# EAGLE design porcupine4v1_5 (EAGLE 5.11)
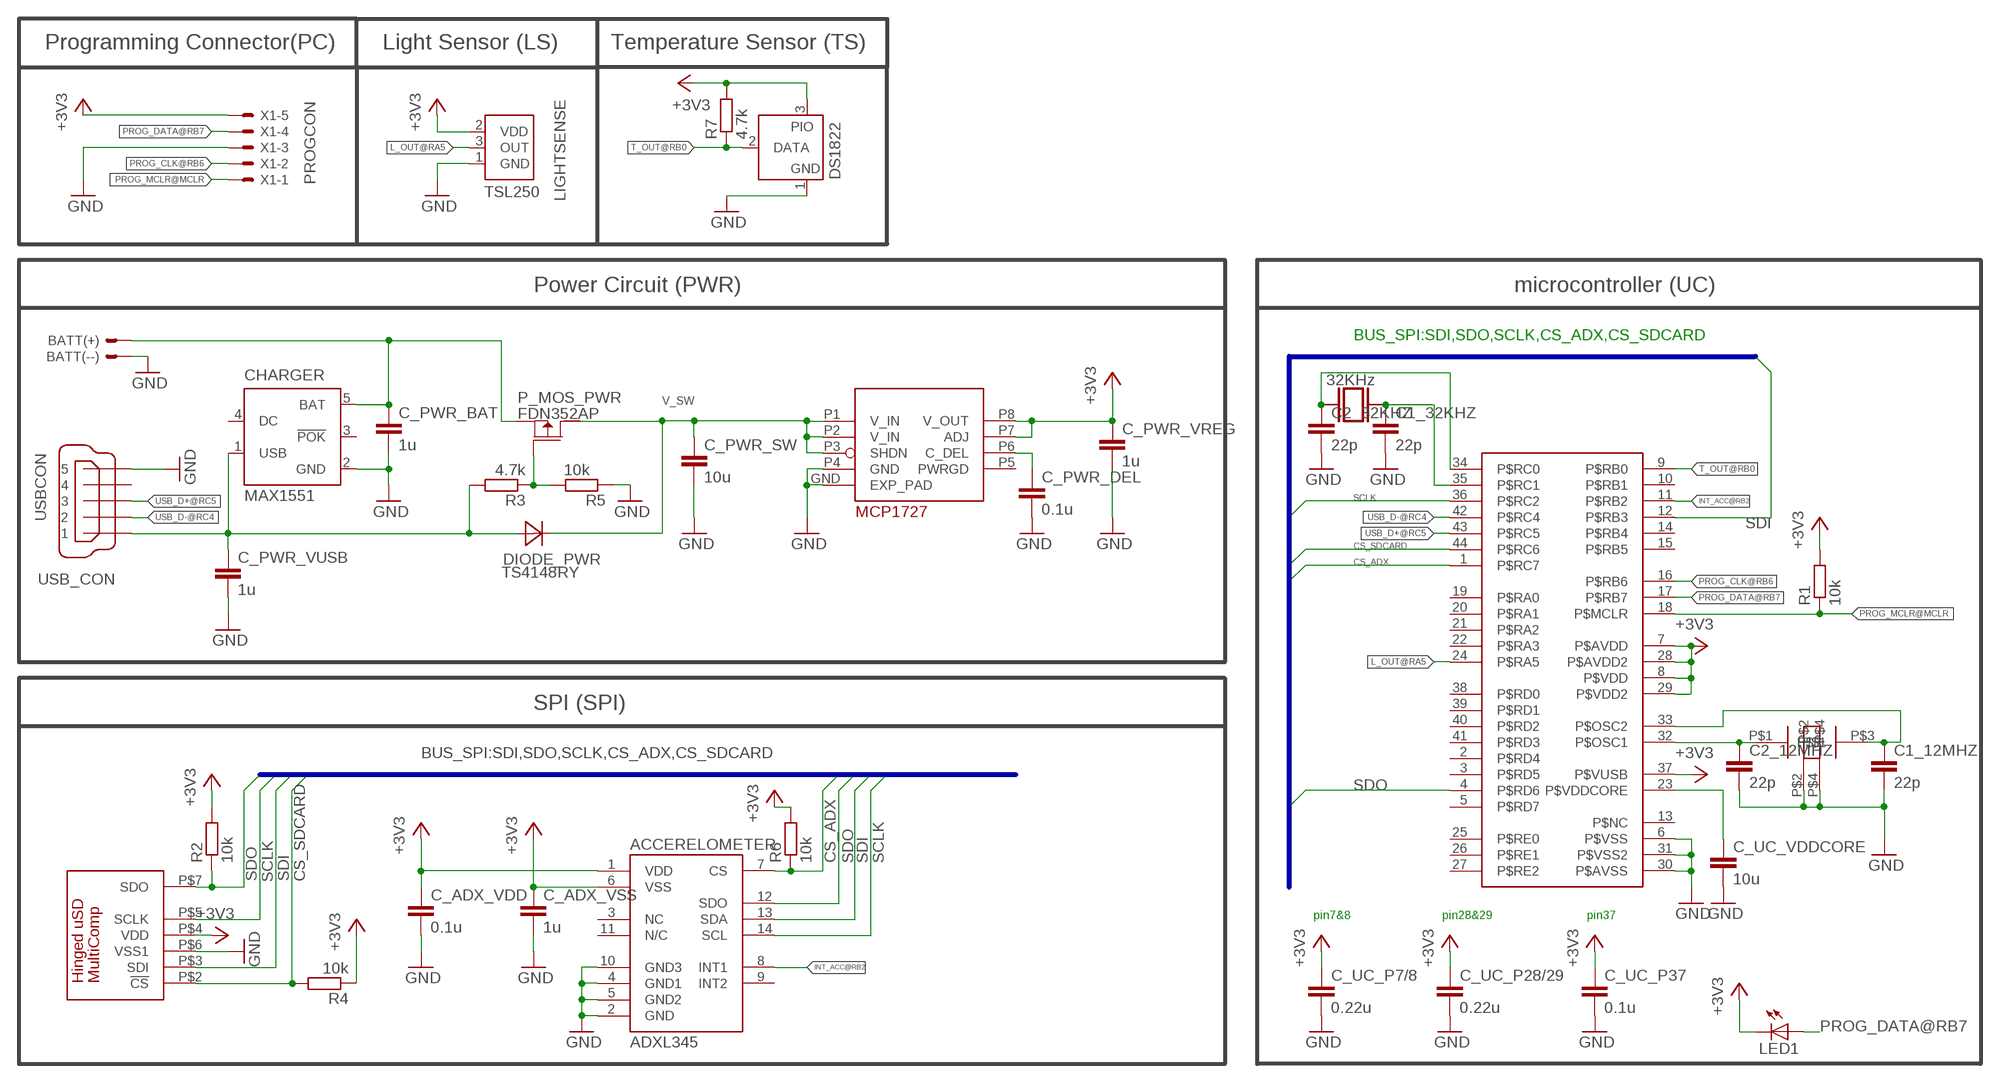
[diagram p0: schematic, sheet 1]

## Parts
ACCERELOMETER  ADXL345  [LGA14]
BATT  LI-ION-PACK  [LI-ION-CONNECT]
C1_12MHZ  22p  C-EUC0603K  [C0603K]
C1_32KHZ  22p  C-EUC0603K  [C0603K]
C2_12MHZ  22p  C-EUC0603K  [C0603K]
C2_32KHZ  22p  C-EUC0603K  [C0603K]
C_ADX_VDD  0.1u  C-EUC0603K  [C0603K]
C_ADX_VSS  1u  C-EUC0603K  [C0603K]
C_PWR_BAT  1u  C-EUC0603K  [C0603K]
C_PWR_DEL  0.1u  C-EUC0603K  [C0603K]
C_PWR_SW  10u  C-EUC0805K  [C0805K]
C_PWR_VREG  1u  C-EUC0603K  [C0603K]
C_PWR_VUSB  1u  C-EUC0603K  [C0603K]
C_UC_P7/8  0.22u  C-EUC0603K  [C0603K]
C_UC_P28/29  0.22u  C-EUC0603K  [C0603K]
C_UC_P37  0.1u  C-EUC0603K  [C0603K]
C_UC_VDDCORE  10u  C-EUC0805K  [C0805K]
CHARGER  MAX1551  [SOT23-5L]
CRYSTAL_12MHZ  12MHz  12MHZSMDCRYSTAL  [ABM3B]
CRYSTAL_32KHZ  32KHz  XTALSLOW  [TC26HSMD]
DIODE_PWR  TS4148RY  DIODE  [C0805]
LED1  LEDCHIPLED_0805  [CHIPLED_0805]
LIGHTSENSE  TSL250  [TSL]
P_MOS_PWR  FDN352AP  [SUPERSOT-3]
PIC_CONTROLLER  PIC_P2V6  [QFN44ML8X8]
R1  10k  R-EU_R0603  [R0603]
R2  10k  R-EU_R0603  [R0603]
R3  4.7k  R-EU_R0603  [R0603]
R4  10k  R-EU_R0603  [R0603]
R5  10k  R-EU_R0603  [R0603]
R6  10k  R-EU_R0603  [R0603]
R7  4.7k  R-EU_R0603  [R0603]
SDCARD_CON  MICROSD_CONN  [460DA40013]
TEMPSENSE  DS1822  DS2405  [TO92-]
USB_CON  USBCON  [248601]
VOLTAGEREG  MCP1727  [MCP_DFN_3X3X0.9]
X1  PROGCON  [53047-05-OCT]

## Nets
+3V3: ACCERELOMETER.1(VDD) ACCERELOMETER.6(VSS) C_ADX_VDD.1 C_ADX_VSS.1 C_PWR_VREG.1 C_UC_P7/8.1 C_UC_P28/29.1 C_UC_P37.1 LED1.C LIGHTSENSE.2(VDD) PIC_CONTROLLER.7(P$AVDD) PIC_CONTROLLER.8(P$VDD) PIC_CONTROLLER.28(P$AVDD2) PIC_CONTROLLER.29(P$VDD2) PIC_CONTROLLER.37(P$VUSB) R1.2 R2.2 R4.1 R6.2 R7.2 SDCARD_CON.P$4(VDD) TEMPSENSE.3(PIO) VOLTAGEREG.P7(ADJ) VOLTAGEREG.P8(V_OUT) X1.5
CS_ADX: ACCERELOMETER.7(CS) PIC_CONTROLLER.1(P$RC7) R6.1
CS_SDCARD: PIC_CONTROLLER.44(P$RC6) R4.2 SDCARD_CON.P$2(!CS)
GND: ACCERELOMETER.2(GND) ACCERELOMETER.4(GND1) ACCERELOMETER.5(GND2) ACCERELOMETER.10(GND3) BATT.3 C1_12MHZ.2 C1_32KHZ.2 C2_12MHZ.2 C2_32KHZ.2 C_ADX_VDD.2 C_ADX_VSS.2 C_PWR_BAT.2 C_PWR_DEL.2 C_PWR_SW.2 C_PWR_VREG.2 C_PWR_VUSB.2 C_UC_P7/8.2 C_UC_P28/29.2 C_UC_P37.2 C_UC_VDDCORE.2 CHARGER.2(GND) CRYSTAL_12MHZ.P$2 CRYSTAL_12MHZ.P$4 LIGHTSENSE.1(GND) PIC_CONTROLLER.6(P$VSS) PIC_CONTROLLER.30(P$AVSS) PIC_CONTROLLER.31(P$VSS2) R5.1 SDCARD_CON.P$6(VSS1) TEMPSENSE.1(GND) USB_CON.5 VOLTAGEREG.GND(EXP_PAD) VOLTAGEREG.P4(GND) X1.3
INT_ACC@RB2: ACCERELOMETER.8(INT1) PIC_CONTROLLER.11(P$RB2)
L_OUT@RA5: LIGHTSENSE.3(OUT) PIC_CONTROLLER.24(P$RA5)
N$1: P_MOS_PWR.1(G) R3.1 R5.2
N$3: C2_32KHZ.1 CRYSTAL_32KHZ.P$2 PIC_CONTROLLER.34(P$RC0)
N$4: C_PWR_DEL.1 VOLTAGEREG.P6(C_DEL)
N$6: C1_32KHZ.1 CRYSTAL_32KHZ.P$1 PIC_CONTROLLER.35(P$RC1)
N$8: C_UC_VDDCORE.1 PIC_CONTROLLER.23(P$VDDCORE)
OSC3: C2_12MHZ.1 CRYSTAL_12MHZ.P$1 PIC_CONTROLLER.32(P$OSC1)
OSC4: C1_12MHZ.1 CRYSTAL_12MHZ.P$3 PIC_CONTROLLER.33(P$OSC2)
PROG_CLK@RB6: PIC_CONTROLLER.16(P$RB6) X1.2
PROG_DATA@RB7: LED1.A PIC_CONTROLLER.17(P$RB7) X1.4
PROG_MCLR@MCLR: PIC_CONTROLLER.18(P$MCLR) R1.1 X1.1
SCLK: ACCERELOMETER.14(SCL) PIC_CONTROLLER.36(P$RC2) SDCARD_CON.P$5(SCLK)
SDI: ACCERELOMETER.13(SDA) PIC_CONTROLLER.12(P$RB3) SDCARD_CON.P$3(SDI)
SDO: ACCERELOMETER.12(SDO) PIC_CONTROLLER.4(P$RD6) R2.1 SDCARD_CON.P$7(SDO)
T_OUT@RB0: PIC_CONTROLLER.9(P$RB0) R7.1 TEMPSENSE.2(DATA)
USB_D+@RC5: PIC_CONTROLLER.43(P$RC5) USB_CON.3
USB_D-@RC4: PIC_CONTROLLER.42(P$RC4) USB_CON.2
V_BAT: BATT.1 C_PWR_BAT.1 CHARGER.5(BAT) P_MOS_PWR.2(S)
V_SW: C_PWR_SW.1 DIODE_PWR.2(C) P_MOS_PWR.3(D) VOLTAGEREG.P1(V_IN) VOLTAGEREG.P2(V_IN) VOLTAGEREG.P3(SHDN)
V_USB: C_PWR_VUSB.1 CHARGER.1(USB) DIODE_PWR.1(A) R3.2 USB_CON.1
Unconnected: ACCERELOMETER.3(NC) ACCERELOMETER.9(INT2) ACCERELOMETER.11(N/C) BATT.2 CHARGER.3(!POK) CHARGER.4(DC) PIC_CONTROLLER.2(P$RD4) PIC_CONTROLLER.10(P$RB1) PIC_CONTROLLER.13(P$NC) PIC_CONTROLLER.14(P$RB4) PIC_CONTROLLER.15(P$RB5) PIC_CONTROLLER.19(P$RA0) PIC_CONTROLLER.20(P$RA1) PIC_CONTROLLER.21(P$RA2) PIC_CONTROLLER.22(P$RA3) PIC_CONTROLLER.25(P$RE0) PIC_CONTROLLER.26(P$RE1) PIC_CONTROLLER.27(P$RE2) PIC_CONTROLLER.38(P$RD0) PIC_CONTROLLER.39(P$RD1) PIC_CONTROLLER.40(P$RD2) PIC_CONTROLLER.41(P$RD3) USB_CON.4 VOLTAGEREG.P5(PWRGD)

## Buses
BUS_SPI:SDI,SDO,SCLK,CS_ADX,CS_SDCARD

## Notes on the sheet
- Programming Connector(PC) | Light Sensor (LS) | Temperature Sensor (TS)
- Power Circuit (PWR) | microcontroller (UC)
- SPI (SPI)
- pin7&8 | pin28&29 | pin37

## Power pins joined to a net without a drawn wire
P$RD5: PIC_CONTROLLER.3(P$RD5)
P$RD7: PIC_CONTROLLER.5(P$RD7)

## Library data of the parts
ACCERELOMETER = HedgehogLib:ADXL345
BATT = HedgehogLib:LI-ION-PACK: Lithium Ion Battery Pack
C1_12MHZ C1_32KHZ C2_12MHZ C2_32KHZ C_ADX_VDD C_ADX_VSS C_PWR_BAT C_PWR_DEL C_PWR_SW C_PWR_VREG C_PWR_VUSB C_UC_P7/8 C_UC_P28/29 C_UC_P37 C_UC_VDDCORE = rcl:C-EU: CAPACITOR, European symbol
CHARGER = maxim:MAX1551: Dual-Input USB/AC Adapter 1-Cell Li+ Battery Chargers Source: http://www.maxim-ic.com .. MAX1551-MAX1555.pdf; MF: MAXIM; MPN: MAX1551EZK-T; OC_FARNELL: 1628221; OC_NEWARK: 88H0599
CRYSTAL_12MHZ = HedgehogLib:12MHZSMDCRYSTAL
CRYSTAL_32KHZ = HedgehogLib:XTAL
DIODE_PWR = HedgehogLib:DIODE
LED1 = led:LED: LED OSRAM: - CHIPLED LG R971, LG N971, LY N971, LG Q971, LY Q971, LO R971, LY R971 LH N974, LH R974 LS Q976, LO Q976, LY Q976 LO Q996 - Hyper CHIPLED LW Q18S LB Q993, LB Q99A, LB R99A - SideLED LS A670, LO A670, LY A670, LG A670, LP A670 LB A673, LV A673, LT A673, LW A673 LH A674 LY A675 LS A676, LA A676, LO A676, LY A676, LW A676 LS A679, LY A679, LG A679 - Hyper Micro SIDELED® LS Y876, LA Y876, LO Y876, LY Y876 LT Y87S - SmartLED LW L88C, LW L88S LB L89C, LB L89S, LG L890 LS L89K, LO L89K, LY L89K LS L896, LA L896, LO L896, LY L896 - TOPLED LS T670, LO T670, LY T670, LG T670, LP T670 LSG T670, LSP T670, LSY T670, LOP T670, LYG T670 LG T671, LOG T671, LSG T671 LB T673, LV T673, LT T673, LW T673 LH T674 LS T676, LA T676, LO T676, LY T676, LB T676, LH T676, LSB T676, LW T676 LB T67C, LV T67C, LT T67C, LS T67K, LO T67K, LY T67K, LW E67C LS E67B, LA E67B, LO E67B, LY E67B, LB E67C, LV E67C, LT E67C LW T67C LS T679, LY T679, LG T679 LS T770, LO T770, LY T770, LG T770, LP T770 LB T773, LV T773, LT T773, LW T773 LH T774 LS E675, LA E675, LY E675, LS T675 LS T776, LA T776, LO T776, LY T776, LB T776 LHGB T686 LT T68C, LB T68C - Hyper Mini TOPLED® LB M676 - Mini TOPLED Santana® LG M470 LS M47K, LO M47K, LY M47K Source: http://www.osram.convergy.de LUXEON: - LUMILED® LXK2-PW12-R00, LXK2-PW12-S00, LXK2-PW14-U00, LXK2-PW14-V00 LXK2-PM12-R00, LXK2-PM12-S00, LXK2-PM14-U00 LXK2-PE12-Q00, LXK2-PE12-R00, LXK2-PE12-S00, LXK2-PE14-T00, LXK2-PE14-U00 LXK2-PB12-K00, LXK2-PB12-L00, LXK2-PB12-M00, LXK2-PB14-N00, LXK2-PB14-P00, LXK2-PB14-Q00 LXK2-PR12-L00, LXK2-PR12-M00, LXK2-PR14-Q00, LXK2-PR14-R00 LXK2-PD12-Q00, LXK2-PD12-R00, LXK2-PD12-S00 LXK2-PH12-R00, LXK2-PH12-S00 LXK2-PL12-P00, LXK2-PL12-Q00, LXK2-PL12-R00 Source: www.luxeon.com KINGBRIGHT: KA-3528ASYC Source: www.kingbright.com
LIGHTSENSE = HedgehogLib:TSL250
P_MOS_PWR = HedgehogLib:FDN352AP
PIC_CONTROLLER = HedgehogLib:PIC_P2V6
R1-R7 = rcl:R-EU_: RESISTOR, European symbol
SDCARD_CON = HedgehogLib:MICROSD_CONN
TEMPSENSE = maxim:DS2405: Addressable Switch DALLAS Semiconductor; MF: DALLAS SEMICONDUCTOR; MPN: DS2405; OC_FARNELL: 1188025; OC_NEWARK: 06F4645
USB_CON = HedgehogLib:USBCON: MINI USB 2.0 Connector TypeB
VOLTAGEREG = HedgehogLib:MCP1727
X1 = HedgehogLib:PROGCON: Programmer Connector wire to board 1.25 mm (.049 inch) pitch header

## Board
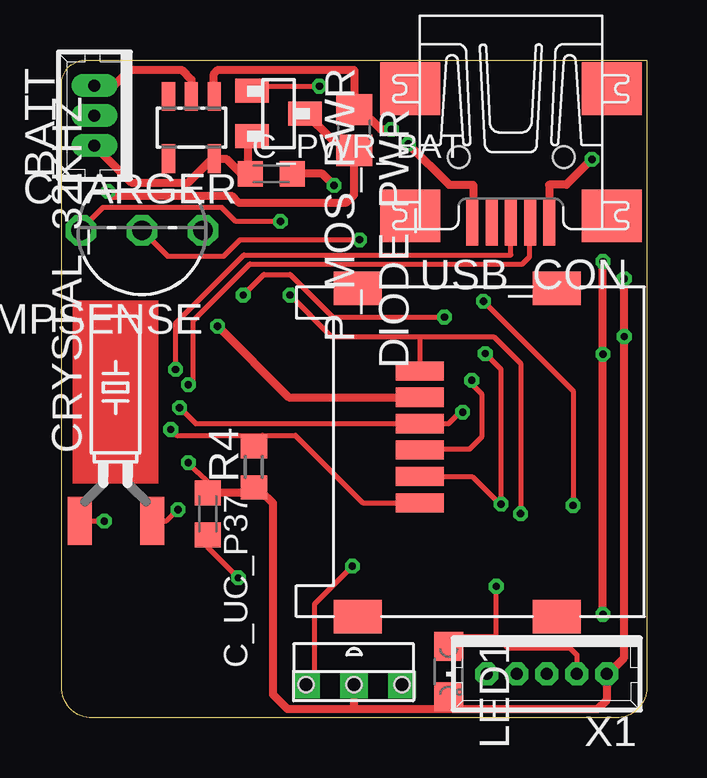
[diagram p1: board, top side]
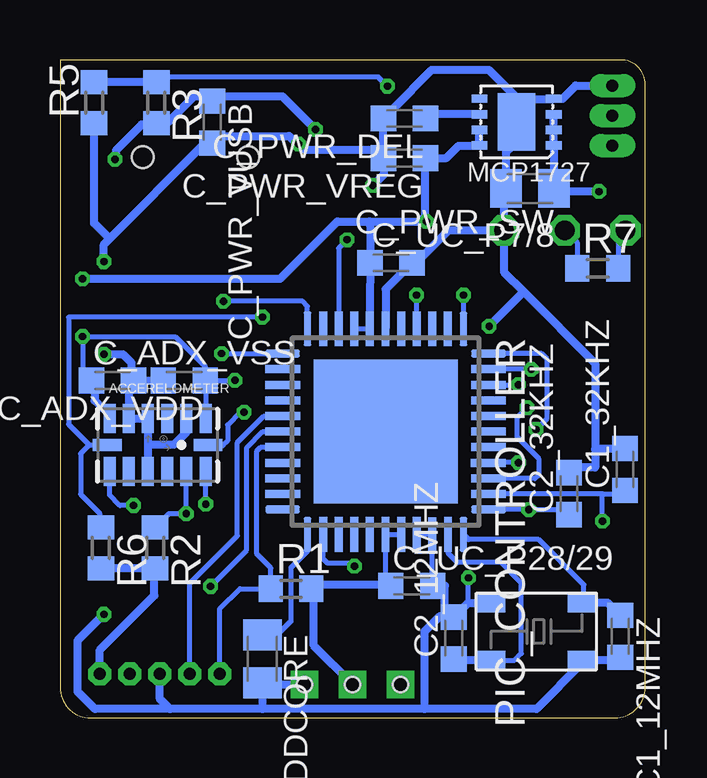
[diagram p2: board, bottom side, seen from below]

Size 24.38 x 27.43 mm. Coordinates in mm from the lower left corner, seen from the top.
Outline: 1.27,0 arc-90 0,1.27 0,26.42 arc-90 1.02,27.43 24.38,27.43 24.38,1.27 arc-90 23.11,0 1.27,0
Copper layers (1*16): Top 0.035mm / dielectric 1.5mm / Bottom 0.035mm
Design rules "default *": minimum track width 6mil, minimum drill 12mil, track to track 7mil, track to pad 7mil, pad to pad 7mil, via to via 7mil, smd to smd 7mil, copper to edge 6mil, drill to drill 6mil, minimum pad ring 9mil, minimum via ring 6mil, stop-mask expansion 4mil, vias tented up to drill 0mil, thermal gap 10mil

### Footprints (pad centres in the part's own frame; a part is rotated, then mirrored left to right if it is on the bottom)
LGA14 = smd 0.5 x 1.2: 1 2,1.1; 2 1.2,1.1; 3 0.4,1.1; 4 -0.4,1.1; 5 -1.2,1.1; 6 -2,1.1; 8 -2,-1.1; 9 -1.2,-1.1; 10 -0.4,-1.1; 11 0.4,-1.1; 12 1.2,-1.1; 13 2,-1.1 | smd 1.2 x 0.5: 7 -2.1,0; 14 2.1,0
LI-ION-CONNECT = drill 0.5 pad 0.698 long: 1 -2.5,0; 2 -1.25,0; 3 0,0
C0603K = smd 1.05 x 1.08: 1 -0.875,0; 2 0.875,0
C0805K = smd 1.3 x 1.6: 1 -1,0; 2 1,0
SOT23-5L = smd 0.55 x 1.2: 1 -0.95,-1.3; 2 0,-1.3; 3 0.95,-1.3; 4 0.95,1.3; 5 -0.95,1.3
ABM3B = smd 1.2 x 0.8: P$1 0.6,0.4; P$2 4.4,0.4; P$3 4.4,2.8; P$4 0.6,2.8
TC26HSMD = smd 1 x 2: P$1 -1.5,-0.8; P$2 1.522,-0.8
C0805 = smd 1.3 x 1.5: 1 -0.85,0; 2 0.85,0
CHIPLED_0805 = smd 1.2 x 1.2: A 0,-1.05; C 0,1.05
TSL = drill 0.635 pad 1.15 square: 1 -1.999,0; 2 0,0; 3 1.999,0 | hole 0.635: 0,0; -2,0; 2,0
SUPERSOT-3 = smd 1 x 1.4: 1 -0.95,-1.1; 2 0.95,-1.1; 3 0,1.1
QFN44ML8X8 = smd 1.45 x 0.33: 1 -4.282,3.25; 2 -4.285,2.6; 3 -4.285,1.95; 4 -4.285,1.3; 5 -4.285,0.65; 6 -4.287,0; 7 -4.285,-0.649; 8 -4.287,-1.3; 9 -4.287,-1.949; 10 -4.285,-2.6; 11 -4.285,-3.25; 23 4.285,-3.25; 24 4.287,-2.6; 25 4.287,-1.95; 26 4.287,-1.3; 27 4.287,-0.652; 28 4.287,0; 29 4.287,0.65; 30 4.292,1.3; 31 4.293,1.953; 32 4.293,2.602; 33 4.285,3.25 | smd 0.33 x 1.45: 12 -3.25,-4.288; 13 -2.6,-4.287; 14 -1.949,-4.287; 15 -1.3,-4.287; 16 -0.65,-4.287; 17 0,-4.287; 18 0.65,-4.287; 19 1.3,-4.287; 20 1.95,-4.287; 21 2.6,-4.287; 22 3.25,-4.285; 34 3.25,4.288; 35 2.6,4.287; 36 1.95,4.287; 37 1.3,4.285; 38 0.65,4.287; 39 0,4.287; 40 -0.649,4.287; 41 -1.3,4.287; 42 -1.949,4.287; 43 -2.6,4.287; 44 -3.25,4.288 | smd 6 x 6: EXP 0,0
R0603 = smd 1 x 1.1: 1 -0.85,0; 2 0.85,0
460DA40013 = smd 2 x 0.8: P$2 9.35,-4.75; P$3 9.35,-5.85; P$4 9.35,-6.95; P$5 9.35,-8.05; P$6 9.35,-9.15; P$7 9.35,-10.25 | smd 2 x 1.4: P$9A 11.95,0; P$9B 3.65,0; P$10A 11.95,-13.7; P$10B 3.65,-13.7
TO92- = drill 0.813 octagon: 1 -2.54,0; 2 0,0; 3 2.54,0
248601 = smd 2 x 0.5: 1 2.25,1.6; 2 2.25,0.8; 3 2.25,0; 4 2.25,-0.8; 5 2.25,-1.6 | smd 2.2 x 2.5: M1 -3.3,-4.2; M2 -3.3,4.2; M3 2,4.2; M4 2,-4.2 | hole 0.9: -0.449,-2.177; -0.447,2.21
MCP_DFN_3X3X0.9 = smd 2.4 x 1.55: GND 0,-1.55 | smd 0.35 x 0.65: P1 0.975,0; P2 0.325,0; P3 -0.325,0; P4 -0.975,0; P5 -0.975,-3.1; P6 -0.325,-3.1; P7 0.325,-3.1; P8 0.975,-3.1
53047-05-OCT = drill 0.5 pad 0.889 octagon: 1 2.5,0; 2 1.25,0; 3 0,0; 4 -1.25,0; 5 -2.5,0

### Placement (x,y rotation side)
ACCERELOMETER  20.32,11.38 0 bottom
BATT  1.37,26.37 90 top
C1_12MHZ  1.04,3.4 270 bottom
C1_32KHZ  0.84,10.36 90 bottom
C2_12MHZ  7.98,3.33 90 bottom
C2_32KHZ  3.17,9.35 90 bottom
C_ADX_VDD  19.2,14.07 180 bottom
C_ADX_VSS  22.2,14.07 0 bottom
C_PWR_BAT  8.74,22.68 0 top
C_PWR_DEL  10.03,24.99 180 bottom
C_PWR_SW  4.8,22.07 180 bottom
C_PWR_VREG  10.03,23.34 180 bottom
C_PWR_VUSB  18.04,24.84 270 bottom
C_UC_P7/8  10.59,18.97 0 bottom
C_UC_P28/29  9.72,5.51 0 bottom
C_UC_P37  6.09,8.51 270 top
C_UC_VDDCORE  15.95,2.46 270 bottom
CHARGER  5.41,24.61 180 top
CRYSTAL_12MHZ  7.04,2.01 0 bottom
CRYSTAL_32KHZ  2.25,9.02 0 top
DIODE_PWR  12.19,24.51 270 top
LED1  16.13,1.93 180 top
LIGHTSENSE  12.19,1.4 180 top
P_MOS_PWR  9.04,25.2 270 top
PIC_CONTROLLER  10.82,11.94 270 bottom
R1  14.76,5.38 0 bottom
R2  20.42,7.09 270 bottom
R3  20.37,25.65 270 bottom
R4  8.01,10.46 90 top
R5  22.96,25.65 90 bottom
R6  22.68,7.09 270 bottom
R7  1.98,18.75 0 bottom
SDCARD_CON  24.28,4.22 180 top
TEMPSENSE  3.35,20.32 180 top
USB_CON  18.72,22.93 270 top
VOLTAGEREG  3.81,24.84 270 bottom
X1  20.22,1.83 180 top

### Tracks (layer width: path | path; a pad name or v marks a point on that pad's centre or on a via)
+3V3  (via drill 0.3)
  Top 0.203: SDCARD_CON.P$4 14.97,11.2 16.99,11.2 17.5,11.71 17.5,13.51 17.09,13.92 v17.09,14.07 | TEMPSENSE.3 0.81,20.37 1.73,21.29 6.68,21.29 7.26,20.7 v9.12,20.7 | C_UC_P37.1 6.09,9.83 5.7,10.22 v5.28,10.64
  Top 0.254: LED1.C 16.15,0.78 16.15,0.37
  Top 0.33: v23.44,18.31 v23.44,15.9 23.44,2.52 22.76,1.83 X1.5 22.73,1.81 22.73,0.76 22.34,0.37 16.15,0.37 12.19,0.37 | 12.19,0.37 LIGHTSENSE.2 | 12.19,0.37 9.41,0.37 8.81,0.96 8.81,8.95 8.33,9.43 | SDCARD_CON.P$4 14.92,11.15 | 8.33,9.43 R4.1 | 8.33,9.43 8.33,9.38 C_UC_P37.1
  Bottom 0.203: ACCERELOMETER.1 18.32,13.84 C_ADX_VDD.1 | PIC_CONTROLLER.7 PIC_CONTROLLER.8 | 23.19,13.93 C_ADX_VSS.1 23.1,14.03 23.44,14.38 v23.44,15.9 19.58,15.9 18.34,14.66 18.34,13.85 C_ADX_VDD.1 | PIC_CONTROLLER.29 PIC_CONTROLLER.28 10.82,5.89 10.46,5.54 C_UC_P28/29.1 | v5.28,10.64 PIC_CONTROLLER.37 | C_ADX_VDD.1 v17.09,14.07 | R7.2 1.13,20 TEMPSENSE.3
  Bottom 0.33: ACCERELOMETER.6 22.32,12.91 22.61,12.91 22.94,13.23 22.94,13.81 C_ADX_VSS.1 | C_ADX_VDD.1 18.18,13.95 | VOLTAGEREG.P7 VOLTAGEREG.P8 6.93,23.85 7.77,23.85 8.28,23.34 C_PWR_VREG.1 9.16,20.91 9.37,20.7 | v23.44,18.31 15.21,18.31 12.83,20.7 11.48,20.7 | 10.87,5.56 10.66,5.58 C_UC_P28/29.1 10.88,5.56 13.73,5.56 R1.2 13.81,5.29 13.81,3.01 LIGHTSENSE.2 | 11.48,20.7 9.37,20.7 | 9.37,20.7 v9.12,20.7 | PIC_CONTROLLER.7 11.47,17.25 C_UC_P7/8.1 11.47,20.54 11.48,20.7 | R6.2 R2.2 20.45,6.27 20.45,5.11 22.72,2.83 X1.5
CS_ADX  (via drill 0.3)
  Top 0.203: v7.57,17.63 8.43,18.49 9.53,18.49 11.3,16.71 v15.95,16.71
  Bottom 0.203: PIC_CONTROLLER.1 7.57,17.37 v7.57,17.63 | v15.95,16.71 24.03,16.71 24.03,12.24 23.16,11.38 | 23.16,11.38 ACCERELOMETER.7 | 23.16,11.38 23.52,11.02 23.52,9.32 22.73,8.53 22.73,7.99 R6.1
CS_SDCARD  (via drill 0.3)
  Top 0.203: SDCARD_CON.P$2 12.56,8.97 9.74,11.79 8.38,11.79 | v4.55,12.03 4.8,11.78 8.38,11.79 | R4.2 8.38,11.12 8.38,11.79
  Bottom 0.203: PIC_CONTROLLER.44 4.32,15.19 4.09,14.96 4.09,12.49 v4.55,12.03
GND  (via drill 0.3, 0.3 pad 0.3)
  Top 0.203: C_UC_P37.2 6.09,7.12 v7.37,5.84
  Top 0.33: USB_CON.5 17.14,20.58 17.14,22.23 16.15,22.23 v14.45,23.93 | CHARGER.2 5.41,26.62 5,27.03 2.85,27.03 2.18,26.36 BATT.3 | C_PWR_BAT.2 10.87,22.68 v11.35,22.2 | v22.55,19.02 v22.55,15.16 v22.55,4.32 | SDCARD_CON.P$6 9.47,13.37 v6.5,16.33
  Bottom 0.203: PIC_CONTROLLER.30 PIC_CONTROLLER.31 8.87,5.97 8.87,5.68 C_UC_P28/29.2 | C_PWR_SW.2 5.89,22.26 | 21.52,13.82 21.44,13.82 C_ADX_VSS.2 | v7.37,5.84 7.37,5.66 7.37,4.81
  Bottom 0.305: C2_12MHZ.2 8.07,4.29
  Bottom 0.33: CRYSTAL_12MHZ.P$4 6.74,4.79 | C1_12MHZ.2 0.76,2.9 1.25,2.41 CRYSTAL_12MHZ.P$2 | CRYSTAL_12MHZ.P$2 2.62,2.43 | 21.52,13.82 ACCERELOMETER.5 ACCERELOMETER.4 20.72,11.39 | 20.72,11.39 ACCERELOMETER.10 | ACCERELOMETER.2 19.12,11.91 19.63,11.39 20.72,11.39 | C_ADX_VDD.2 C_ADX_VSS.2 21.41,13.9 21.41,14.81 21.77,15.16 v22.55,15.16 | 2.08,11.2 2.08,10.44 3.08,10.44 C2_32KHZ.2 | C1_32KHZ.2 2.05,11.24 2.08,11.2 | CRYSTAL_12MHZ.P$4 6.25,4.81 | BATT.3 2.9,26.36 3.44,25.82 VOLTAGEREG.P4 3.82,25.81 4.75,25.81 5.22,25.34 | C_PWR_VREG.2 10.91,24.18 C_PWR_DEL.2 10.53,25.39 8.9,27.02 6.51,27.02 CHARGER.2 5.41,25.53 5.22,25.34 | 5.22,25.34 5.36,25.2 VOLTAGEREG.GND 5.28,24.76 5.28,24 5.8,23.61 C_PWR_SW.2 | C_PWR_VREG.2 11.13,23.7 14.22,23.7 v14.45,23.93 14.5,23.93 14.83,24.26 18.02,24.26 C_PWR_VUSB.2 18.46,23.85 22.31,19.98 | v11.35,22.2 10.9,22.66 10.9,23.46 C_PWR_VREG.2 | 15.94,0.38 C_UC_VDDCORE.2 15.64,1.46 15.57,1.4 LIGHTSENSE.1 | 15.94,0.38 19.81,0.38 | v22.55,19.02 22.55,19.74 22.31,19.98 | 19.81,0.38 22.93,0.38 23.65,1.09 23.65,3.23 v22.55,4.32 | 7.94,4.24 C2_12MHZ.2 | CRYSTAL_12MHZ.P$4 7.37,4.81 7.94,4.24 | C2_12MHZ.2 8.01,4.33 | TEMPSENSE.1 8.2,20.32 9.55,18.97 C_UC_P7/8.2 10.82,17.87 PIC_CONTROLLER.6 | 5.89,22.26 TEMPSENSE.1 | CRYSTAL_12MHZ.P$2 2.64,2.27 4.53,0.38 9.19,0.38 | 9.19,0.38 15.94,0.38 | 7.94,4.24 8.56,4.24 9.19,3.61 9.19,0.38 | C_UC_P28/29.2 8.35,5.51 8.35,4.49 7.98,4.27 C2_12MHZ.2 | 2.08,11.2 2.08,14.78 5.07,17.77 | 5.07,17.77 5.89,18.59 TEMPSENSE.1 | 5.07,17.77 v6.5,16.33 | 19.81,0.38 20.22,0.79 X1.3 | R5.1 22.96,20.62 22.31,19.98
INT_ACC@RB2  (via drill 0.3)
  Top 0.203: v21.32,8.86 21.32,13.63 v17.58,17.37
  Bottom 0.203: ACCERELOMETER.8 22.32,9.29 21.89,8.86 v21.32,8.86 | v17.58,17.37 14.28,17.37 14.07,17.17 PIC_CONTROLLER.11
L_OUT@RA5  (via drill 0.3)
  Top 0.203: LIGHTSENSE.3 10.54,1.42 10.54,4.75 v12.12,6.33
  Bottom 0.203: PIC_CONTROLLER.24 13.42,6.64 13.23,6.45 12.24,6.45 v12.12,6.33
N$1  (via drill 0.3)
  Top 0.203: v10.74,26.34 8.11,26.34 P_MOS_PWR.1
  Bottom 0.203: R3.1 20.31,26.5 20.09,26.72 11.12,26.72 v10.74,26.34
  Bottom 0.33: R3.1 R5.2
N$3  (via drill 0.3)
  Top 0.203: 3.67,7.34 CRYSTAL_32KHZ.P$2 4.38,8.22 v4.85,8.69
  Bottom 0.203: C2_32KHZ.1 3.26,8.69 v4.85,8.69 PIC_CONTROLLER.34
N$4
  Bottom 0.33: C_PWR_DEL.1 9.12,25.17 VOLTAGEREG.P6
N$6  (via drill 0.3)
  Top 0.203: CRYSTAL_32KHZ.P$1 1.66,8.22 v1.78,8.2
  Bottom 0.203: PIC_CONTROLLER.35 1.78,9.35 | 1.78,9.35 0.71,9.35 0.7,9.47 C1_32KHZ.1 | v1.78,8.2 1.78,9.35
N$8
  Bottom 0.203: C_UC_VDDCORE.1 15.83,3.58 15.21,3.58 14.76,4.04 14.76,6.27 14.07,6.96 PIC_CONTROLLER.23
OSC3
  Bottom 0.203: 6.58,2.43 CRYSTAL_12MHZ.P$1 5.44,2.41 5.16,2.69 5.16,5.64 5.99,6.48 7.82,6.48 8.2,6.86 8.2,7.63 PIC_CONTROLLER.32 8.18,7.61 | C2_12MHZ.1 7.91,2.41 8.19,2.44
  Bottom 0.33: C2_12MHZ.1 7.93,2.41 CRYSTAL_12MHZ.P$1
OSC4
  Bottom 0.203: 2.16,4.76 CRYSTAL_12MHZ.P$3 2.55,4.93 2.55,5.55 4.45,7.44 7.36,7.44 PIC_CONTROLLER.33
  Bottom 0.33: C1_12MHZ.1 1.57,4.81 CRYSTAL_12MHZ.P$3
PROG_CLK@RB6
  Bottom 0.203: PIC_CONTROLLER.16 15.88,12.59 16.99,11.48 16.99,7.59 18.97,5.62 X1.2
PROG_DATA@RB7  (via drill 0.3)
  Top 0.203: 18.11,3.4 v18.11,5.49 | 18.11,3.4 18.59,2.92 21.18,2.92 21.47,2.64 X1.4 | LED1.A 16.48,3.41 18.11,3.4
  Bottom 0.203: v18.11,5.49 16.61,6.99 16.61,11.25 15.93,11.94 PIC_CONTROLLER.17
PROG_MCLR@MCLR
  Bottom 0.203: PIC_CONTROLLER.18 16.02,11.29 16.18,11.12 16.18,6.83 15.6,6.25 15.6,5.4 R1.1 16.89,5.38 17.72,4.56 X1.1
SCLK  (via drill 0.3)
  Top 0.203: v16.71,12.75 16.61,12.75 16.13,12.27 SDCARD_CON.P$5 5.59,12.27 v4.92,12.94
  Bottom 0.203: v16.71,12.75 16.87,12.75 17.4,12.22 17.4,11.56 17.6,11.35 18.09,11.35 18.17,11.43 ACCERELOMETER.14 | v4.92,12.94 5.34,12.52 5.34,11.71 4.42,10.79 4.42,10.16 4.6,9.98 PIC_CONTROLLER.36
SDI  (via drill 0.3)
  Top 0.203: v17.65,15.19 18.31,14.53 v18.31,8.91 18.24,8.94 17.11,10.07 SDCARD_CON.P$3
  Bottom 0.203: 15.14,15.21 PIC_CONTROLLER.12 v17.65,15.19 | ACCERELOMETER.13 18.32,9.08 v18.31,8.91
SDO  (via drill 0.3)
  Top 0.203: 14.93,15.9 SDCARD_CON.P$7 | 14.93,15.9 18.01,15.9 19.13,14.78 v19.13,8.51 | 14.93,15.9 11.25,15.9 v9.53,17.63
  Bottom 0.203: ACCERELOMETER.12 v19.13,8.51 19.85,8.51 R2.1 | v9.53,17.63 v9.52,17.62 PIC_CONTROLLER.4
T_OUT@RB0  (via drill 0.3)
  Top 0.203: v12.42,19.94 7.44,19.94 6.76,19.25 4.42,19.25 TEMPSENSE.2
  Bottom 0.203: PIC_CONTROLLER.9 12.78,19.58 v12.42,19.94 | TEMPSENSE.2 2.82,19.79 2.82,18.99 R7.1
USB_D+@RC5  (via drill 0.3)
  Top 0.203: USB_CON.3 18.72,20.56 18.72,19.3 7.59,19.3 4.75,16.46 v4.75,14.53
  Bottom 0.203: v4.75,14.53 v4.76,14.54 PIC_CONTROLLER.43
USB_D-@RC4  (via drill 0.3)
  Top 0.203: USB_CON.2 19.51,20.54 19.51,19.23 19.2,18.92 7.85,18.92 5.49,16.56 5.49,14.1 v5.28,13.89
  Bottom 0.203: v5.28,13.89 5.3,13.89 PIC_CONTROLLER.42
V_BAT
  Top 0.33: CHARGER.5 | 7.72,24.03 P_MOS_PWR.2 7.77,24.08 7.77,22.73 | CHARGER.5 6.86,23.32 7.44,22.73 7.77,22.73 | 7.77,22.73 8.17,22.73 C_PWR_BAT.1 | CHARGER.5 6.27,23.32 5.28,22.33 2.91,22.33 BATT.1
V_SW  (via drill 0.3)
  Top 0.33: P_MOS_PWR.3 10.19,25.2 11.28,24.11 12.18,24.11 DIODE_PWR.2 | DIODE_PWR.2 12.24,24.04 | DIODE_PWR.2 12.22,24.07 | v1.93,21.95 2.11,21.77 7.09,21.77 7.37,21.49 11.87,21.49 12.19,21.81 DIODE_PWR.2
  Bottom 0.33: VOLTAGEREG.P3 VOLTAGEREG.P2 VOLTAGEREG.P1 3.8,23.86 C_PWR_SW.1 3.8,22.37 3.38,21.95 v1.93,21.95
V_USB  (via drill 0.3, 0.3 pad 0.3)
  Top 0.33: 20.32,20.81 USB_CON.1 20.32,20.56 20.32,22.23 21.03,22.23 v22.1,23.29 | DIODE_PWR.1 12.19,27.02 6.52,27.02 6.35,26.85 CHARGER.1 | DIODE_PWR.1 | v13.74,24.54 13.3,24.54 12.38,25.45 12.12,25.45 12.19,25.38 DIODE_PWR.1
  Bottom 0.33: v22.1,23.29 22.06,23.29 22.06,23.66 20.98,24.74 20.43,24.74 R3.2 19.89,24.82 18.81,25.91 18.03,25.91 | 18.03,25.91 18.07,25.96 C_PWR_VUSB.1 | v13.74,24.54 15.11,25.91 18.03,25.91